# EAGLE design mqtt-LightbulbwithtempandIR (EAGLE 8.3.2)
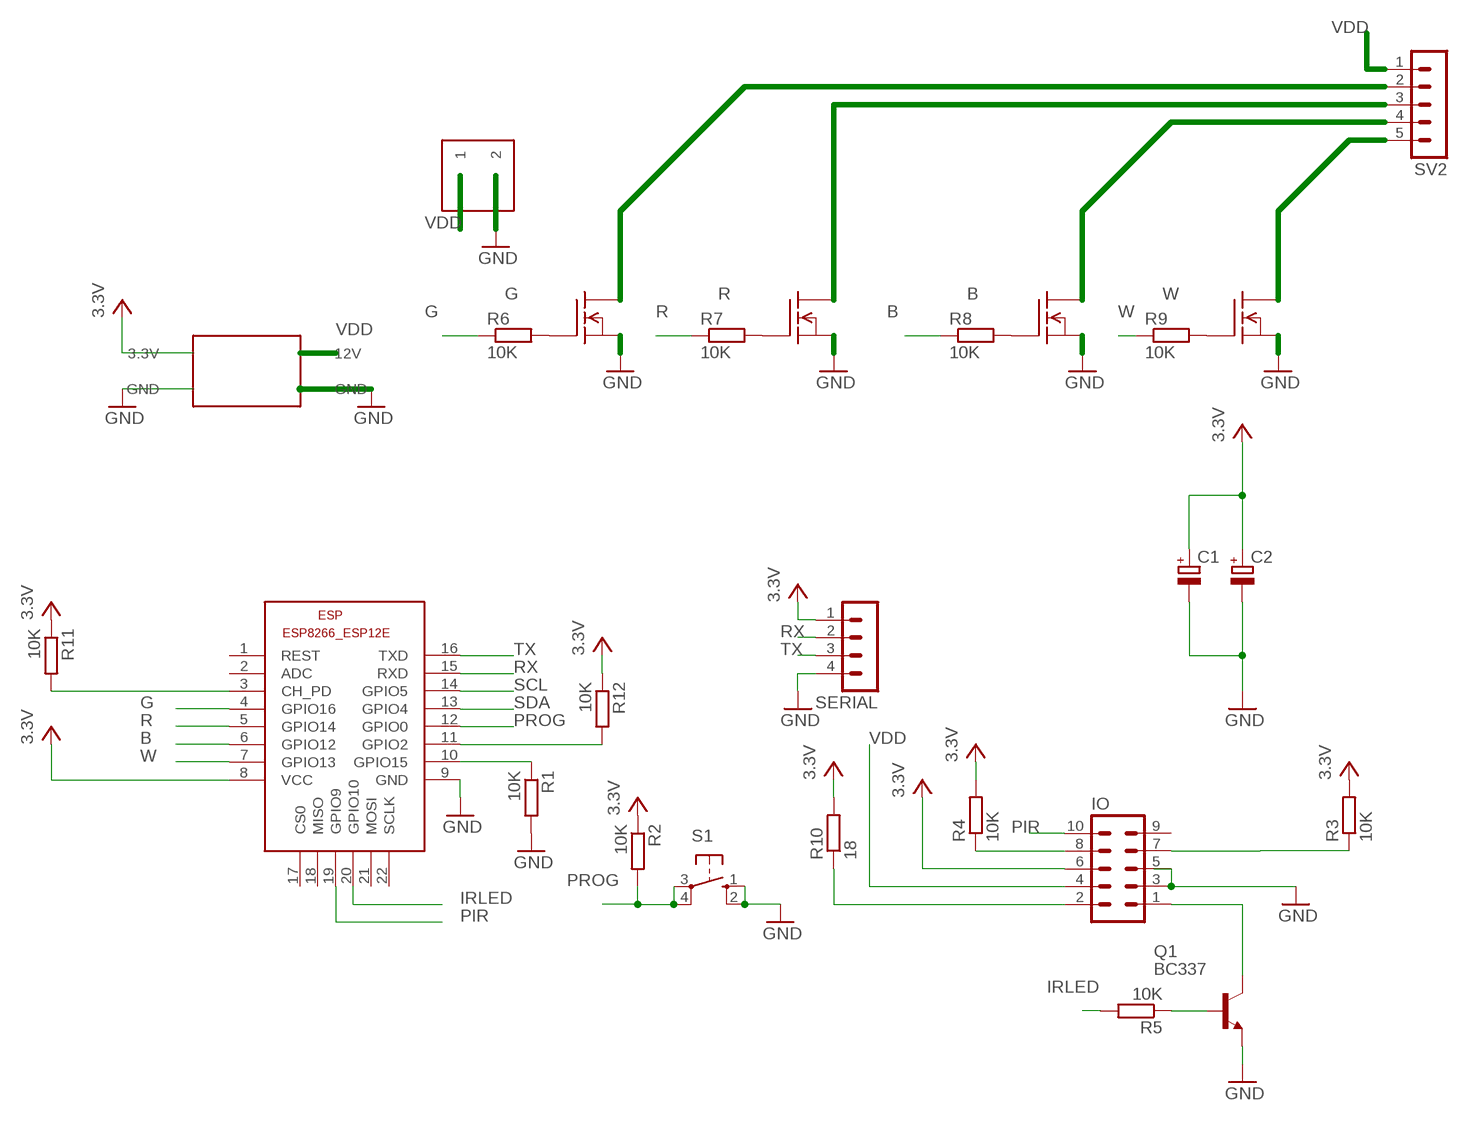
[diagram p0: schematic, sheet 1]

## Parts
B  FDS5680  [SO-8]
C1  CPOL-EUE2-5  [E2-5]
C2  CPOL-EUE2-5  [E2-5]
ESP  ESP8266-12EESP8266-ESP12E  [ESP8266-ESP12E]
G  FDS5680  [SO-8]
IO  MA05-2  [MA05-2]
PWR1  MP2307-MINI-360  [MP2307-MINI-360]
PWR_IN  KF350-P2  [KF350-2P]
Q1  BC337  [TO92]
R  FDS5680  [SO-8]
R1  10K  R-EU_R0603  [R0603]
R2  10K  R-EU_R0603  [R0603]
R3  10K  R-EU_R0603  [R0603]
R4  10K  R-EU_R0603  [R0603]
R5  10K  R-EU_R0603  [R0603]
R6  10K  R-EU_R0603  [R0603]
R7  10K  R-EU_R0603  [R0603]
R8  10K  R-EU_R0603  [R0603]
R9  10K  R-EU_R0603  [R0603]
R10  18  R-EU_R0603  [R0603]
R11  10K  R-EU_R0603  [R0603]
R12  10K  R-EU_R0603  [R0603]
S1  10-XX  [B3F-10XX]
SERIAL  MA04-1  [MA04-1]
SV2  MA05-1  [MA05-1]
W  FDS5680  [SO-8]

## Nets
B: ESP.6(GPIO12) R8.1
DB: B.5(D) B.6(D) B.7(D) B.8(D) SV2.4
DG: G.5(D) G.6(D) G.7(D) G.8(D) SV2.2
DR: R.5(D) R.6(D) R.7(D) R.8(D) SV2.3
DW: SV2.5 W.5(D) W.6(D) W.7(D) W.8(D)
G: ESP.4(GPIO16) R6.1
GND: B.1(S) B.2(S) B.3(S) C1.- C2.- ESP.9(GND) G.1(S) G.2(S) G.3(S) IO.3 IO.5 PWR1.GND@1(GND) PWR1.GND@2(GND) PWR_IN.2 Q1.1(E) R1.2 R.1(S) R.2(S) R.3(S) S1.1(S) S1.2(S1) SERIAL.4 W.1(S) W.2(S) W.3(S)
IRLED: ESP.20(GPIO10) R5.2
N$2: ESP.10(GPIO15) R1.1
N$3: ESP.3(CH_PD) R11.2
N$4: ESP.11(GPIO2) R12.2
N$5: G.4(G) R6.2
N$7: Q1.2(B) R5.1
N$8: R7.2 R.4(G)
N$10: B.4(G) R8.2
N$13: R9.2 W.4(G)
N$17: IO.2 R10.1
N$18: IO.1 Q1.3(C)
PIR: ESP.19(GPIO9) IO.10
PROG: ESP.12(GPIO0) R2.2 S1.3(P) S1.4(P1)
R: ESP.5(GPIO14) R7.1
RX: ESP.15(RXD) SERIAL.2
SCL: ESP.14(GPIO5) IO.7 R3.1
SDA: ESP.13(GPIO4) IO.8 R4.1
TX: ESP.16(TXD) SERIAL.3
VCC: C1.+ C2.+ ESP.8(VCC) IO.6 PWR1.3.3V R2.1 R3.2 R4.2 R10.2 R11.1 R12.1 SERIAL.1 ; supply symbol labelled 3.3V
VDD: IO.4 PWR1.12V PWR_IN.1 SV2.1
W: ESP.7(GPIO13) R9.1
Unconnected: ESP.1(REST) ESP.2(ADC) ESP.17(CS0) ESP.18(MISO) ESP.21(MOSI) ESP.22(SCLK) IO.9

## Library data of the parts
B G R W = transistor-fet:FDS5680: 60V N-Channel PowerTrench TM MOSFET FAIRCHILD FDS5680.pdf
C1 C2 = resistor:CPOL-EU: POLARIZED CAPACITOR, European symbol
ESP = ESP8266-ESP12E:ESP8266-12E: ESP8266-12E with additional I/O and GPIO04/05 corrected The author cannot warrant that this library is free from error or will meet your specific requirements. Created by PuceBaboon.com. Komagane, Nagano, JAPAN
IO = con-lstb:MA05-2: PIN HEADER; OC_FARNELL: unknown; OC_NEWARK: unknown
PWR1 = MP2307-MINI-360:MP2307-MINI-360
PWR_IN = KF350-P2:KF350-P2
Q1 = transistor-npn:BC337*: NPN Transistor
R1-R12 = resistor:R-EU_: RESISTOR, European symbol
S1 = switch-omron:10-XX: OMRON SWITCH; MPN: B3F-1000; OC_FARNELL: 176432; OC_NEWARK: 36M3542
SERIAL = con-lstb:MA04-1: PIN HEADER; OC_FARNELL: unknown; OC_NEWARK: unknown
SV2 = con-lstb:MA05-1: PIN HEADER; OC_FARNELL: unknown; OC_NEWARK: unknown

## Board
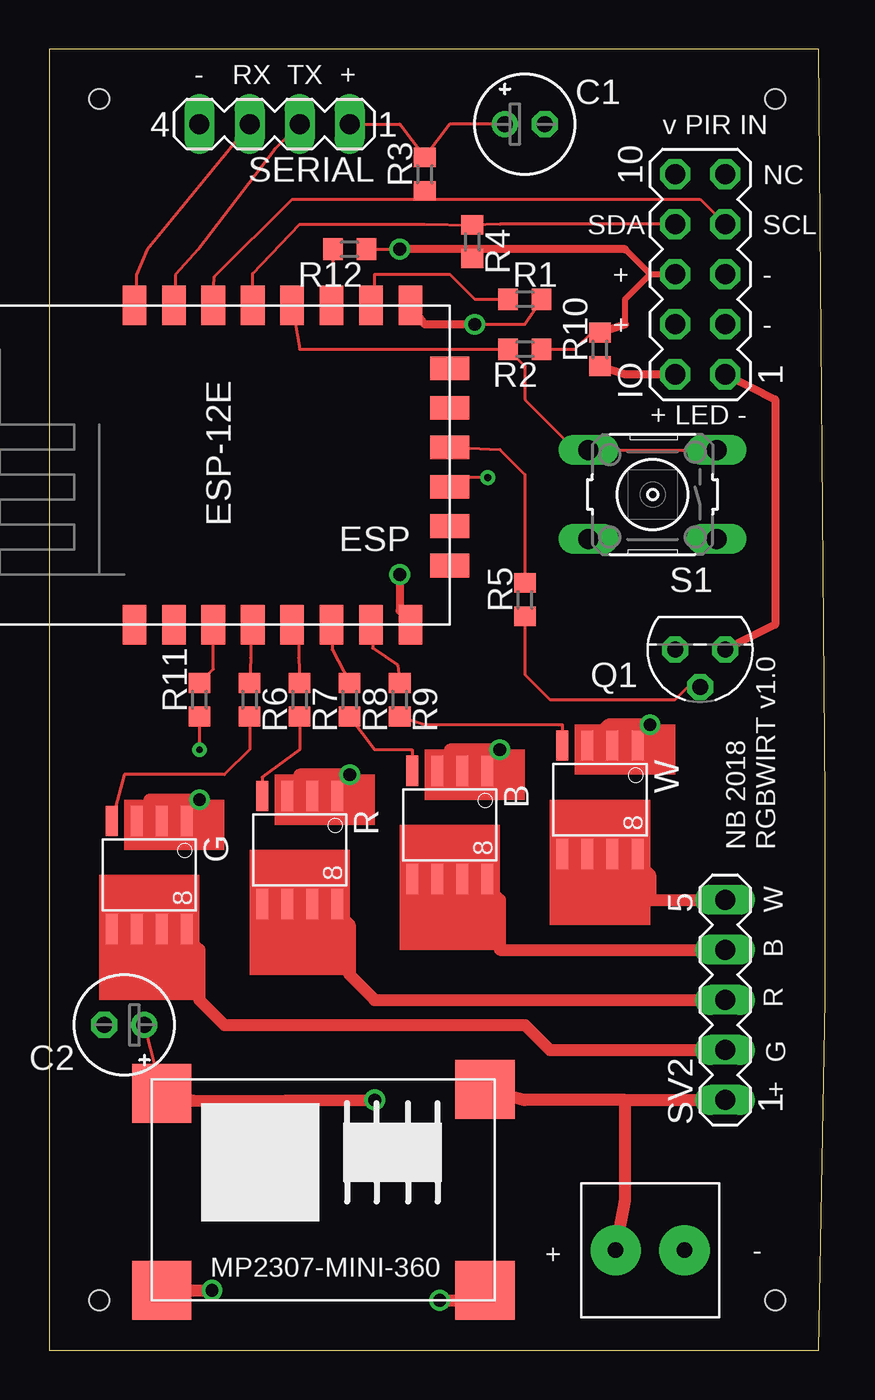
[diagram p1: board, top side]
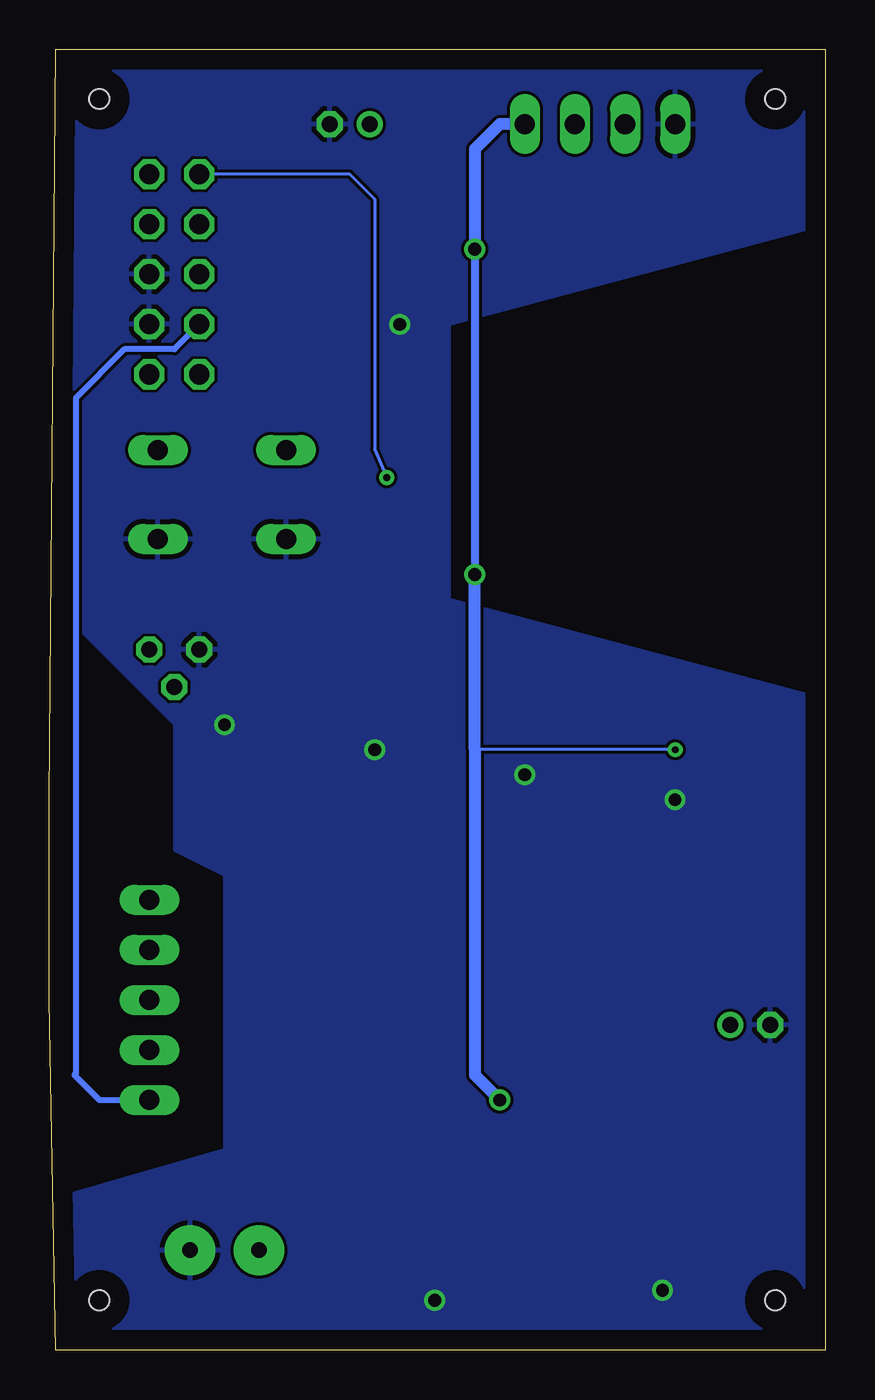
[diagram p2: board, bottom side, seen from below]

Size 39.37 x 66.03 mm. Coordinates in mm from the lower left corner, seen from the top.
Outline: 0,0 39.04,0 39.37,17.78 39.37,27.94 39.04,66.03 0,66.03 0,0
Copper layers (1*16): Top 0.035mm / dielectric 1.5mm / Bottom 0.035mm
Design rules "default": minimum track width 6mil, minimum drill 0.35mm, track to track 6mil, track to pad 6mil, pad to pad 6mil, via to via 6mil, smd to smd 6mil, copper to edge 40mil, drill to drill 6mil, minimum pad ring 10mil, minimum via ring 8mil, stop-mask expansion 4mil, vias tented up to drill 0mil, thermal gap 10mil
Holes 1 mm at 2.54,63.5 36.83,63.5 2.54,2.54 36.83,2.54

### Footprints (pad centres in the part's own frame; a part is rotated, then mirrored left to right if it is on the bottom)
SO-8 = smd 1.524 x 0.61: 1 -2.743,1.905; 2 -2.743,0.635; 3 -2.743,-0.635; 4 -2.743,-1.905; 5 2.743,-1.905; 6 2.743,-0.635; 7 2.743,0.635; 8 2.743,1.905
E2-5 = drill 0.813 pad 1.27: + -1.016,0 | drill 0.813 pad 1.27 octagon: - 1.016,0
ESP8266-ESP12E = smd 2 x 1.2: 1 -7.62,5.84; 2 -7.62,3.84; 3 -7.62,1.84; 4 -7.62,-0.16; 5 -7.62,-2.16; 6 -7.62,-4.16; 7 -7.62,-6.16; 8 -7.62,-8.16; 9 8.58,-8.16; 10 8.58,-6.16; 11 8.58,-4.16; 12 8.58,-2.16; 13 8.58,-0.16; 14 8.58,1.84; 15 8.58,3.84; 16 8.58,5.84 | smd 1.2 x 2: 17 -4.62,-10.16; 18 -2.62,-10.16; 19 -0.62,-10.16; 20 1.38,-10.16; 21 3.38,-10.16; 22 5.38,-10.16
MA05-2 = drill 1.016 octagon: 1 -5.08,-1.27; 2 -5.08,1.27; 3 -2.54,-1.27; 4 -2.54,1.27; 5 0,-1.27; 6 0,1.27; 7 2.54,-1.27; 8 2.54,1.27; 9 5.08,-1.27; 10 5.08,1.27
MP2307-MINI-360 = smd 3 x 3: 3.3V 0.5,10.5; 12V 16.9,10.7; GND@1 16.9,0.5; GND@2 0.5,0.5
KF350-2P = drill 0.8 pad 2.54: 1 -1.75,0; 2 1.75,0
TO92 = drill 0.813 octagon: 1 1.27,0; 2 0,1.905; 3 -1.27,0
R0603 = smd 1 x 1.1: 1 -0.85,0; 2 0.85,0
B3F-10XX = drill 1.016 long: 1 -3.251,2.261; 2 3.251,2.261; 3 -3.251,-2.261; 4 3.251,-2.261
MA04-1 = drill 1.016 long: 1 -3.81,0; 2 -1.27,0; 3 1.27,0; 4 3.81,0
MA05-1 = drill 1.016 long: 1 -5.08,0; 2 -2.54,0; 3 0,0; 4 2.54,0; 5 5.08,0

### Placement (x,y rotation side)
B  20.32,26.67 270 top
C1  24.13,62.23 0 top
C2  3.81,16.51 180 top
ESP  10.16,44.45 90 top
G  5.08,24.13 270 top
IO  33.02,54.61 90 top
PWR1  5.21,2.54 0 top
PWR_IN  30.48,5.08 0 top
Q1  33.02,35.56 180 top
R  12.7,25.4 270 top
R1  24.13,53.34 0 top
R2  24.13,50.8 180 top
R3  19.05,59.69 90 top
R4  21.46,56.26 270 top
R5  24.13,38.1 90 top
R6  10.16,33.02 270 top
R7  12.7,33.02 270 top
R8  15.24,33.02 270 top
R9  17.78,33.02 270 top
R10  27.94,50.8 90 top
R11  7.62,33.02 90 top
R12  15.24,55.88 180 top
S1  30.61,43.43 180 top
SERIAL  11.43,62.23 180 top
SV2  34.29,17.78 90 top
W  27.94,27.94 270 top

### Tracks (layer width: path | path; a pad name or v marks a point on that pad's centre or on a via)
B
  Top 0.152: R8.1 14.35,35.56 14.33,36.73 ESP.6
DB
  Top 0.61: B.8 22.23,23.49 22.86,22.86 | 22.86,22.86 22.86,20.32 SV2.4 | B.7 20.95,23.49 21.59,22.86 | 21.59,22.86 22.86,22.86 | B.6 19.68,23.49 20.32,22.86 | 20.32,22.86 21.59,22.86 | B.5 18.41,23.49 19.05,22.86 20.32,22.86
DG
  Top 0.61: G.8 6.99,20.95 7.62,20.32 | 7.62,20.32 7.62,17.78 8.89,16.51 24.13,16.51 25.4,15.24 SV2.2 | G.7 5.71,20.95 6.35,20.32 | 6.35,20.32 7.62,20.32 | G.6 4.45,20.95 5.08,20.32 | 5.08,20.32 6.35,20.32 | G.5 3.17,20.95 3.81,20.32 5.08,20.32
DR
  Top 0.61: R.8 14.61,22.23 15.24,21.59 | 15.24,21.59 15.24,19.05 16.51,17.78 SV2.3 | R.7 13.34,22.23 13.97,21.59 | 13.97,21.59 15.24,21.59 | R.6 12.06,22.23 12.7,21.59 | 12.7,21.59 13.97,21.59 | R.5 10.79,22.23 11.43,21.59 12.7,21.59
DW
  Top 0.61: W.8 29.84,24.77 30.48,24.13 | 30.48,24.13 30.48,22.86 SV2.5 | W.7 28.57,24.77 29.21,24.13 | 29.21,24.13 30.48,24.13 | W.6 27.3,24.77 27.94,24.13 | 27.94,24.13 29.21,24.13 | W.5 26.04,24.77 26.67,24.13 27.94,24.13
G
  Top 0.152: 10.4,36.83 ESP.4 10.21,36.73 10.21,35.15 R6.1
GND  (via drill 0.65 pad 0.65)
  Top 0.152: 18.29,53.04 ESP.9 | v21.59,52.07 24.13,52.07 R1.2
  Top 0.406: ESP.9 19.05,52.07 v21.59,52.07
  Top 0.61: PWR1.GND@2 5.85,3.04 v8.26,3.05 | v19.81,2.54 22.75,2.54 PWR1.GND@1 | 6.35,27.94 v7.62,27.94 6.99,27.3 G.1 | 6.35,27.94 5.08,27.94 5.08,27.51 G.3 | G.2 5.71,27.3 6.35,27.94 | 13.97,29.21 v15.24,29.21 14.61,28.57 R.1 | 13.97,29.21 12.7,29.21 12.7,28.78 R.3 | R.2 13.34,28.57 13.97,29.21 | 21.59,30.48 v22.86,30.48 22.23,29.84 B.1 | 21.59,30.48 20.32,30.48 20.32,30.05 B.3 | B.2 20.95,29.84 21.59,30.48 | 29.21,31.75 v30.48,31.75 29.84,31.11 W.1 | 29.21,31.75 28.37,31.75 W.3 | W.2 28.57,31.11 29.21,31.75
  pour Bottom: 0,66.04 39.37,66.04 39.37,38.1 33.02,31.75 33.02,25.4 30.48,24.13 30.48,10.16 39.37,7.62 39.37,0 0,0 0,33.02 19.05,38.1 19.05,52.07 0,57.15
IRLED
  Top 0.152: ESP.20 22.86,45.72 24.13,44.45 R5.2
N$2
  Top 0.152: 16.46,53.34 16.46,53.04 ESP.10 16.51,53.22 16.51,54.61 20.32,54.61 21.59,53.34 R1.1 | 16.46,53.34 16.46,53.65 | 16.51,53.39 16.46,53.34
N$3
  Top 0.152: 8.23,36.73 ESP.3 8.32,34.57 R11.2
N$4
  Top 0.152: R12.2 14.39,53.1 ESP.11
N$5
  Top 0.152: R6.2 10.16,30.48 8.89,29.21 3.81,29.21 G.4
N$7
  Top 0.152: R5.1 24.13,34.29 25.4,33.02 31.75,33.02 32.38,33.66 Q1.2
N$8
  Top 0.152: R7.2 12.7,30.48 10.79,29.08 R.4
N$10
  Top 0.152: R8.2 16.51,30.48 18.41,30.48 B.4
N$13
  Top 0.152: R9.2 19.05,31.75 26.04,31.75 W.4
N$17
  Top 0.406: R10.1 29.21,49.53 IO.2
N$18
  Top 0.406: IO.1 36.83,48.26 36.83,36.83 Q1.3
PIR  (via drill 0.35)
  Top 0.152: 20.27,43.89 ESP.19 20.79,44.3 v22.25,44.3
  Bottom 0.152: v22.25,44.3 22.86,45.72 22.86,58.42 24.13,59.69 IO.10
PROG
  Top 0.152: 27.94,45.7 S1.4 | 27.94,45.7 S1.3 | ESP.12 12.7,50.8 R2.2 24.13,49.95 24.13,48.26 26.7,45.7 27.94,45.7
R
  Top 0.152: R7.1 12.65,35.15 12.65,36.42 12.34,36.73 ESP.5
RX
  Top 0.152: ESP.15 6.4,53.04 6.4,54.59 7.57,55.88 11.43,60.96 SERIAL.2
SCL
  Top 0.152: ESP.14 8.32,53.4 8.38,54.48 12.32,58.42 19.47,58.42 | IO.7 33.02,58.42 19.47,58.42 | 19.47,58.42 R3.1
SDA
  Top 0.152: ESP.13 10.32,54.64 12.7,57.15 19.05,57.15 R4.1 22.86,57.15 IO.8
TX
  Top 0.152: ESP.16 4.42,53.04 4.42,54.56 4.98,55.88 SERIAL.3
VCC  (via drill 0.35, 0.65 pad 0.65)
  Top 0.152: 18.44,36.73 ESP.8 18.44,36.88 | R12.1 v17.78,55.88 | R4.2 21.59,55.88 | 5.42,13.97 6.35,13.04 | R11.1 v7.62,30.48 | R2.1 26.67,50.8 27.56,51.69 28.07,51.69 | SERIAL.1 17.78,62.23 R3.2 20.32,62.23 C1.+ | C2.+ PWR1.3.3V
  Top 0.305: 29.21,52.07 29.21,53.34 30.48,54.61 | 30.48,54.61 IO.6 | 30.48,54.61 29.21,55.88
  Top 0.406: v17.78,39.37 17.78,37.54 18.44,36.88 | R10.2 28.07,51.69 29.21,52.07 | v17.78,55.88 21.59,55.88 29.21,55.88
  Top 0.61: PWR1.3.3V 6.35,13.04 7.33,12.66 v16.51,12.7
  Bottom 0.152: v7.62,30.48 17.78,30.48
  Bottom 0.406: v17.78,55.88 v17.78,39.37
  Bottom 0.61: SERIAL.1 16.51,62.23 17.78,60.96 v17.78,55.88 | v17.78,39.37 17.78,30.48 17.78,13.97 v16.51,12.7
VDD
  Top 0.406: 22.86,13.97 PWR1.12V
  Top 0.61: PWR1.12V 24.13,12.7 29.21,12.7 | 29.21,12.7 SV2.1 | PWR_IN.1 29.21,7.62 29.21,12.7
  Bottom 0.305: IO.4 33.02,50.8 35.56,50.8 38.02,48.34 38.02,14.04 38.1,13.97 36.83,12.7 SV2.1
W
  Top 0.152: R9.1 17.68,34.77 16.41,35.64 16.46,36.73 ESP.7
(copper drawn outside any net)
  shapes: Top area x8

### Text on the board
tPlace: - | RX | TX | + | v PIR IN | NC | SDA | SCL | + | - | + | - | + LED - | NB 2018 / RGBWIRT v1.0 | W | B | R | G | + | + | -